# EAGLE design usb-c-adapter-tester (EAGLE 7.2.0)
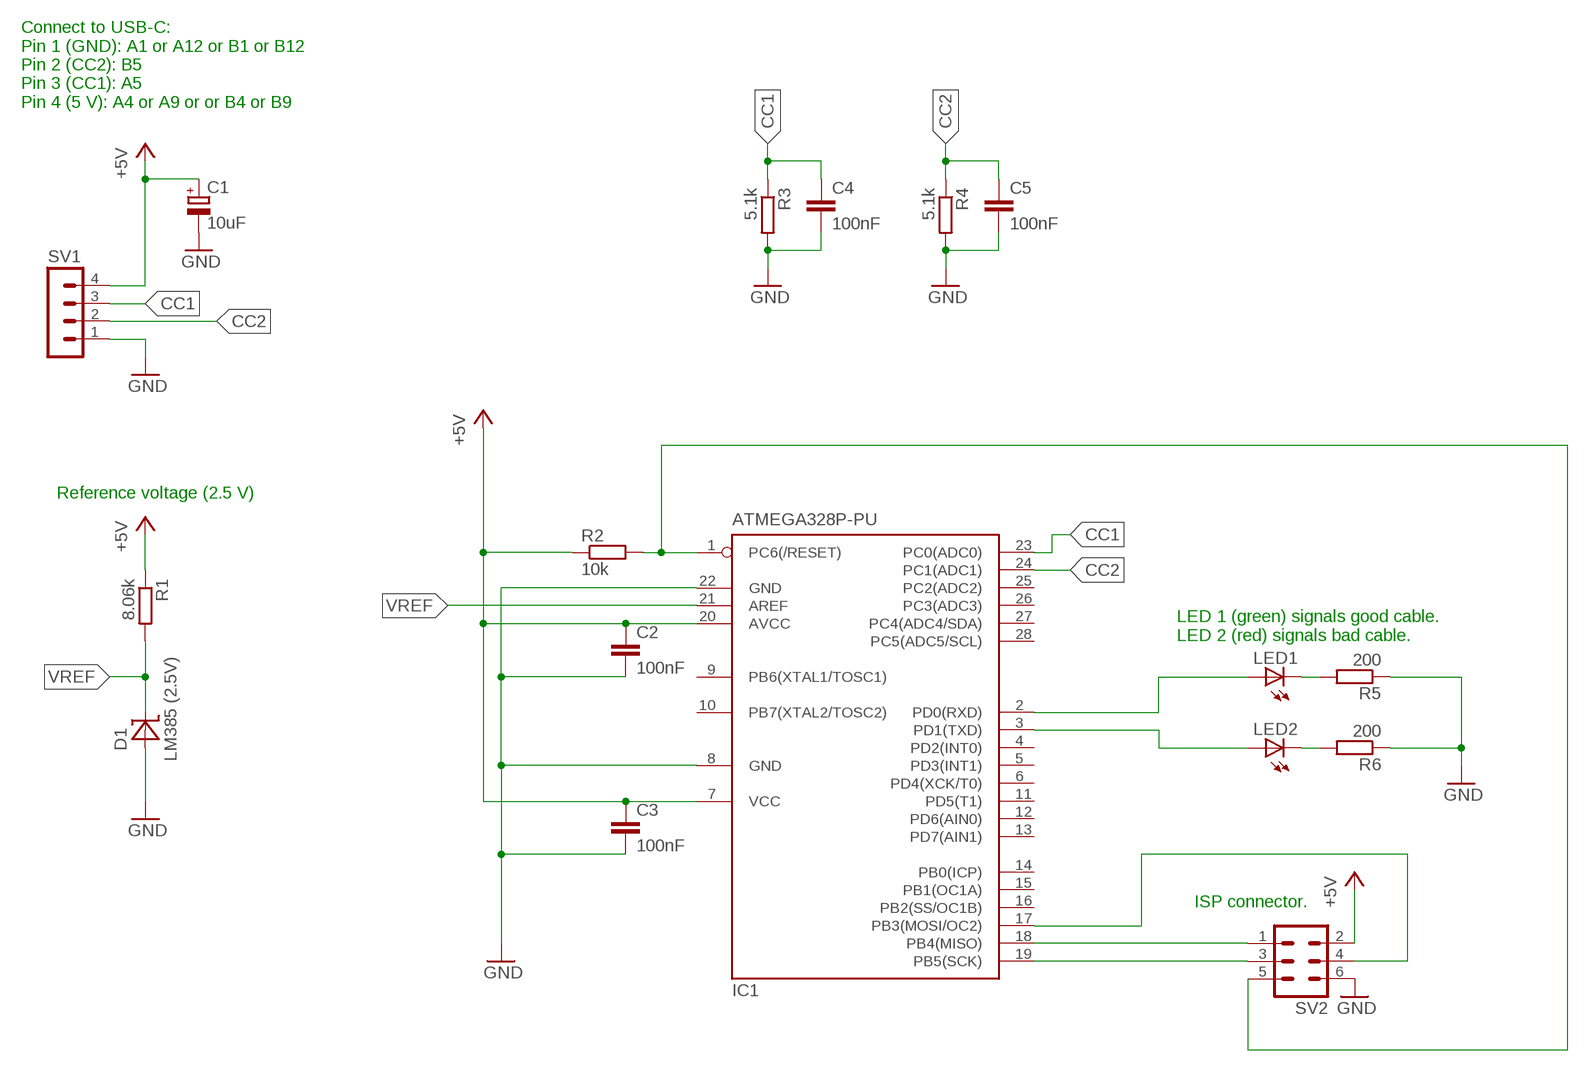
[diagram p0: schematic, sheet 1]

## Parts
C1  10uF  CPOL-EUE2.5-5  [E2,5-5]
C2  100nF  C-EU050-024X044  [C050-024X044]
C3  100nF  C-EU050-024X044  [C050-024X044]
C4  100nF  C-EU050-024X044  [C050-024X044]
C5  100nF  C-EU050-024X044  [C050-024X044]
D1  LM385 (2.5V)  LM385  [TO-92]
IC1  ATMEGA328P-PU  MEGA8-P  [DIL28-3]
LED1  LED5MM  [LED5MM]
LED2  LED5MM  [LED5MM]
R1  8.06k  R-EU_0207/7  [0207/7]
R2  10k  R-EU_0207/7  [0207/7]
R3  5.1k  R-EU_0207/7  [0207/7]
R4  5.1k  R-EU_0207/7  [0207/7]
R5  200  R-EU_0207/7  [0207/7]
R6  200  R-EU_0207/7  [0207/7]
SV1  MA04-1  [MA04-1]
SV2  MA03-2  [MA03-2]

## Nets
CC1: C4.1 IC1.23(PC0(ADC0)) R3.1 SV1.3
CC2: C5.1 IC1.24(PC1(ADC1)) R4.1 SV1.2
GND: C1.- C2.2 C3.2 C4.2 C5.2 D1.+ IC1.8(GND) IC1.22(GND) R3.2 R4.2 R5.1 R6.1 SV1.1 SV2.6
N$2: IC1.1(PC6(/RESET)) R2.2 SV2.5
N$4: LED1.K(C) R5.2
N$6: LED2.K(C) R6.2
N$10: IC1.17(PB3(MOSI/OC2)) SV2.4
N$11: IC1.2(PD0(RXD)) LED1.A
N$12: IC1.18(PB4(MISO)) SV2.1
N$13: IC1.3(PD1(TXD)) LED2.A
N$17: IC1.19(PB5(SCK)) SV2.3
N$18: C1.+ C2.1 C3.1 IC1.7(VCC) IC1.20(AVCC) R1.1 R2.1 SV1.4 SV2.2 ; supply symbol labelled +5V
VREF: D1.- IC1.21(AREF) R1.2
Unconnected: IC1.4(PD2(INT0)) IC1.5(PD3(INT1)) IC1.6(PD4(XCK/T0)) IC1.9(PB6(XTAL1/TOSC1)) IC1.10(PB7(XTAL2/TOSC2)) IC1.11(PD5(T1)) IC1.12(PD6(AIN0)) IC1.13(PD7(AIN1)) IC1.14(PB0(ICP)) IC1.15(PB1(OC1A)) IC1.16(PB2(SS/OC1B)) IC1.25(PC2(ADC2)) IC1.26(PC3(ADC3)) IC1.27(PC4(ADC4/SDA)) IC1.28(PC5(ADC5/SCL))

## Notes on the sheet
- Connect to USB-C:
  Pin 1 (GND): A1 or A12 or B1 or B12
  Pin 2 (CC2): B5
  Pin 3 (CC1): A5
  Pin 4 (5 V): A4 or A9 or or B4 or B9
- Reference voltage (2.5 V)
- LED 1 (green) signals good cable.
  LED 2 (red) signals bad cable.
- ISP connector.

## Library data of the parts
C1 = rcl:CPOL-EU: POLARIZED CAPACITOR, European symbol
C2-C5 = rcl:C-EU: CAPACITOR, European symbol
D1 = lm385:LM385: LM385 LM385 Micropower Voltage Reference
IC1 = atmel:MEGA8-P: MICROCONTROLLER 8 Kbytes FLASH, 1 kbytes SRAM, 512 bytes EEPROM, USART, 4-channel 10 bit ADC, 2-channel 8 bit ADC Pin compatible with Atmega48, ATMega88, ATMega168 Source: avr.lbr; OC_FARNELL: unknown; OC_NEWARK: unknown
LED1 LED2 = led:LED: LED OSRAM: - CHIPLED LG R971, LG N971, LY N971, LG Q971, LY Q971, LO R971, LY R971 LH N974, LH R974 LS Q976, LO Q976, LY Q976 LO Q996 - Hyper CHIPLED LW Q18S LB Q993, LB Q99A, LB R99A - SideLED LS A670, LO A670, LY A670, LG A670, LP A670 LB A673, LV A673, LT A673, LW A673 LH A674 LY A675 LS A676, LA A676, LO A676, LY A676, LW A676 LS A679, LY A679, LG A679 - Hyper Micro SIDELED® LS Y876, LA Y876, LO Y876, LY Y876 LT Y87S - SmartLED LW L88C, LW L88S LB L89C, LB L89S, LG L890 LS L89K, LO L89K, LY L89K LS L896, LA L896, LO L896, LY L896 - TOPLED LS T670, LO T670, LY T670, LG T670, LP T670 LSG T670, LSP T670, LSY T670, LOP T670, LYG T670 LG T671, LOG T671, LSG T671 LB T673, LV T673, LT T673, LW T673 LH T674 LS T676, LA T676, LO T676, LY T676, LB T676, LH T676, LSB T676, LW T676 LB T67C, LV T67C, LT T67C, LS T67K, LO T67K, LY T67K, LW E67C LS E67B, LA E67B, LO E67B, LY E67B, LB E67C, LV E67C, LT E67C LW T67C LS T679, LY T679, LG T679 LS T770, LO T770, LY T770, LG T770, LP T770 LB T773, LV T773, LT T773, LW T773 LH T774 LS E675, LA E675, LY E675, LS T675 LS T776, LA T776, LO T776, LY T776, LB T776 LHGB T686 LT T68C, LB T68C - Hyper Mini TOPLED® LB M676 - Mini TOPLED Santana® LG M470 LS M47K, LO M47K, LY M47K Source: http://www.osram.convergy.de LUXEON: - LUMILED® LXK2-PW12-R00, LXK2-PW12-S00, LXK2-PW14-U00, LXK2-PW14-V00 LXK2-PM12-R00, LXK2-PM12-S00, LXK2-PM14-U00 LXK2-PE12-Q00, LXK2-PE12-R00, LXK2-PE12-S00, LXK2-PE14-T00, LXK2-PE14-U00 LXK2-PB12-K00, LXK2-PB12-L00, LXK2-PB12-M00, LXK2-PB14-N00, LXK2-PB14-P00, LXK2-PB14-Q00 LXK2-PR12-L00, LXK2-PR12-M00, LXK2-PR14-Q00, LXK2-PR14-R00 LXK2-PD12-Q00, LXK2-PD12-R00, LXK2-PD12-S00 LXK2-PH12-R00, LXK2-PH12-S00 LXK2-PL12-P00, LXK2-PL12-Q00, LXK2-PL12-R00 Source: www.luxeon.com KINGBRIGHT: KA-3528ASYC Source: www.kingbright.com
R1-R6 = rcl:R-EU_: RESISTOR, European symbol
SV1 = con-lstb:MA04-1: PIN HEADER; OC_FARNELL: unknown; OC_NEWARK: unknown
SV2 = con-lstb:MA03-2: PIN HEADER; OC_FARNELL: unknown; OC_NEWARK: unknown

## Board
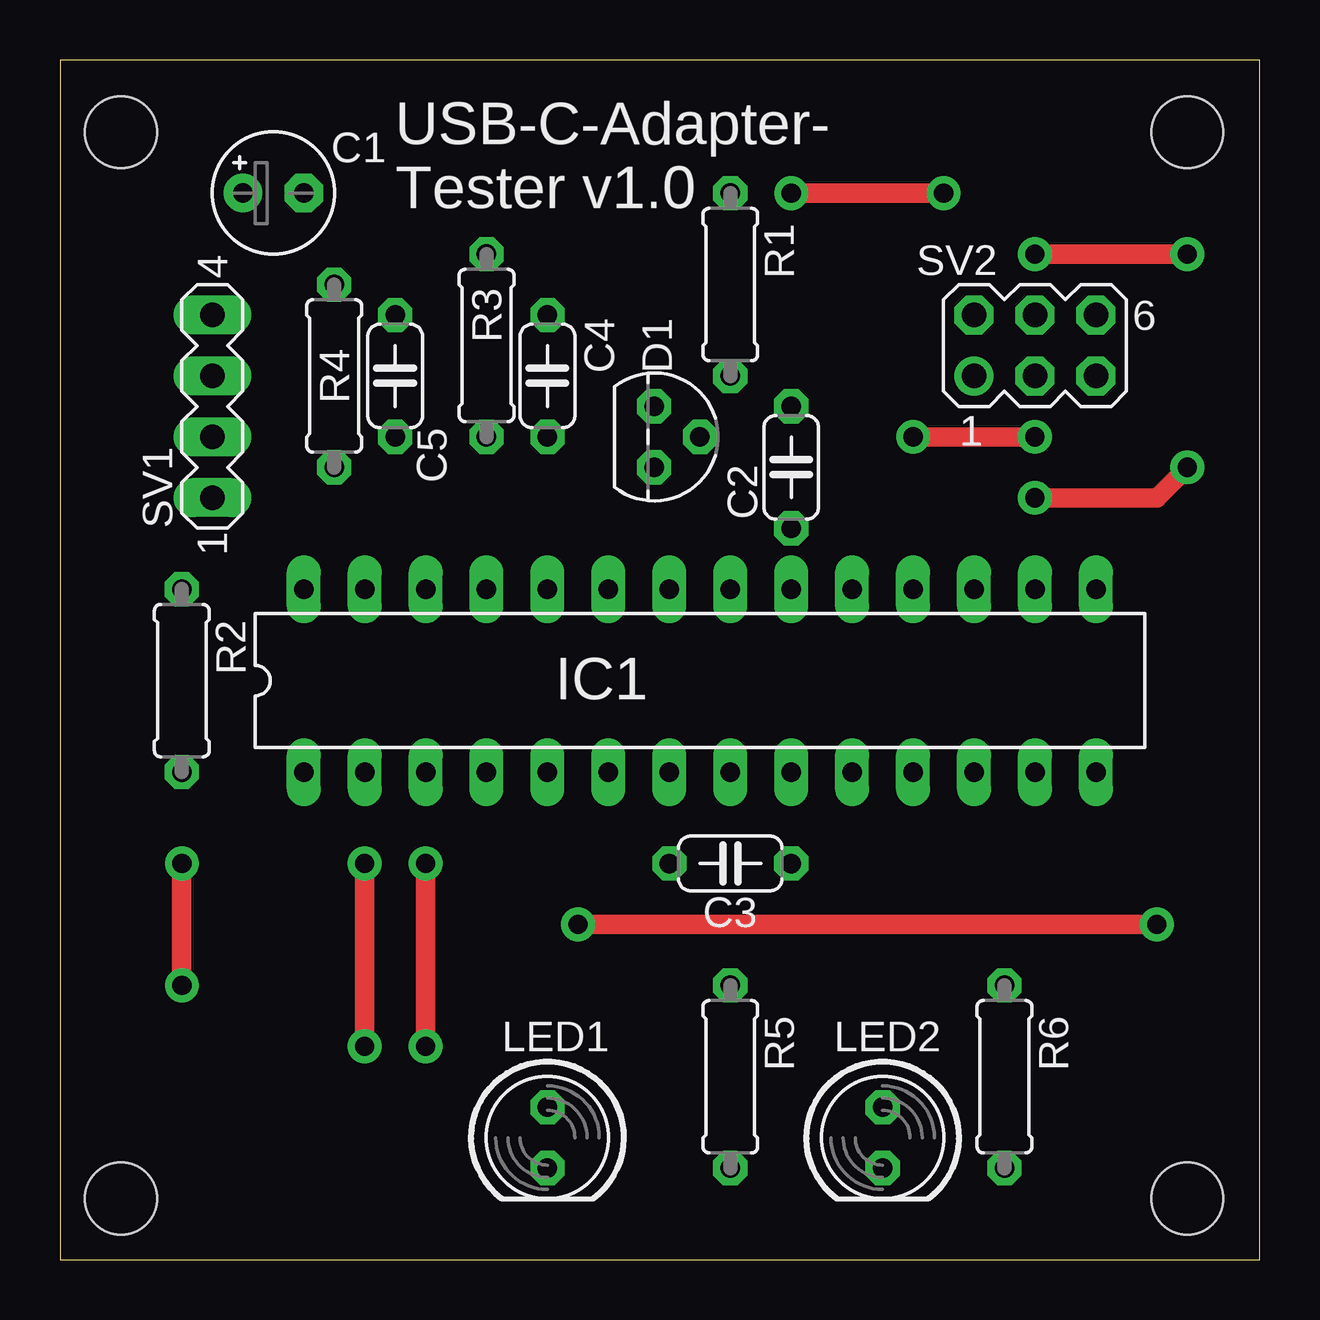
[diagram p1: board, top side]
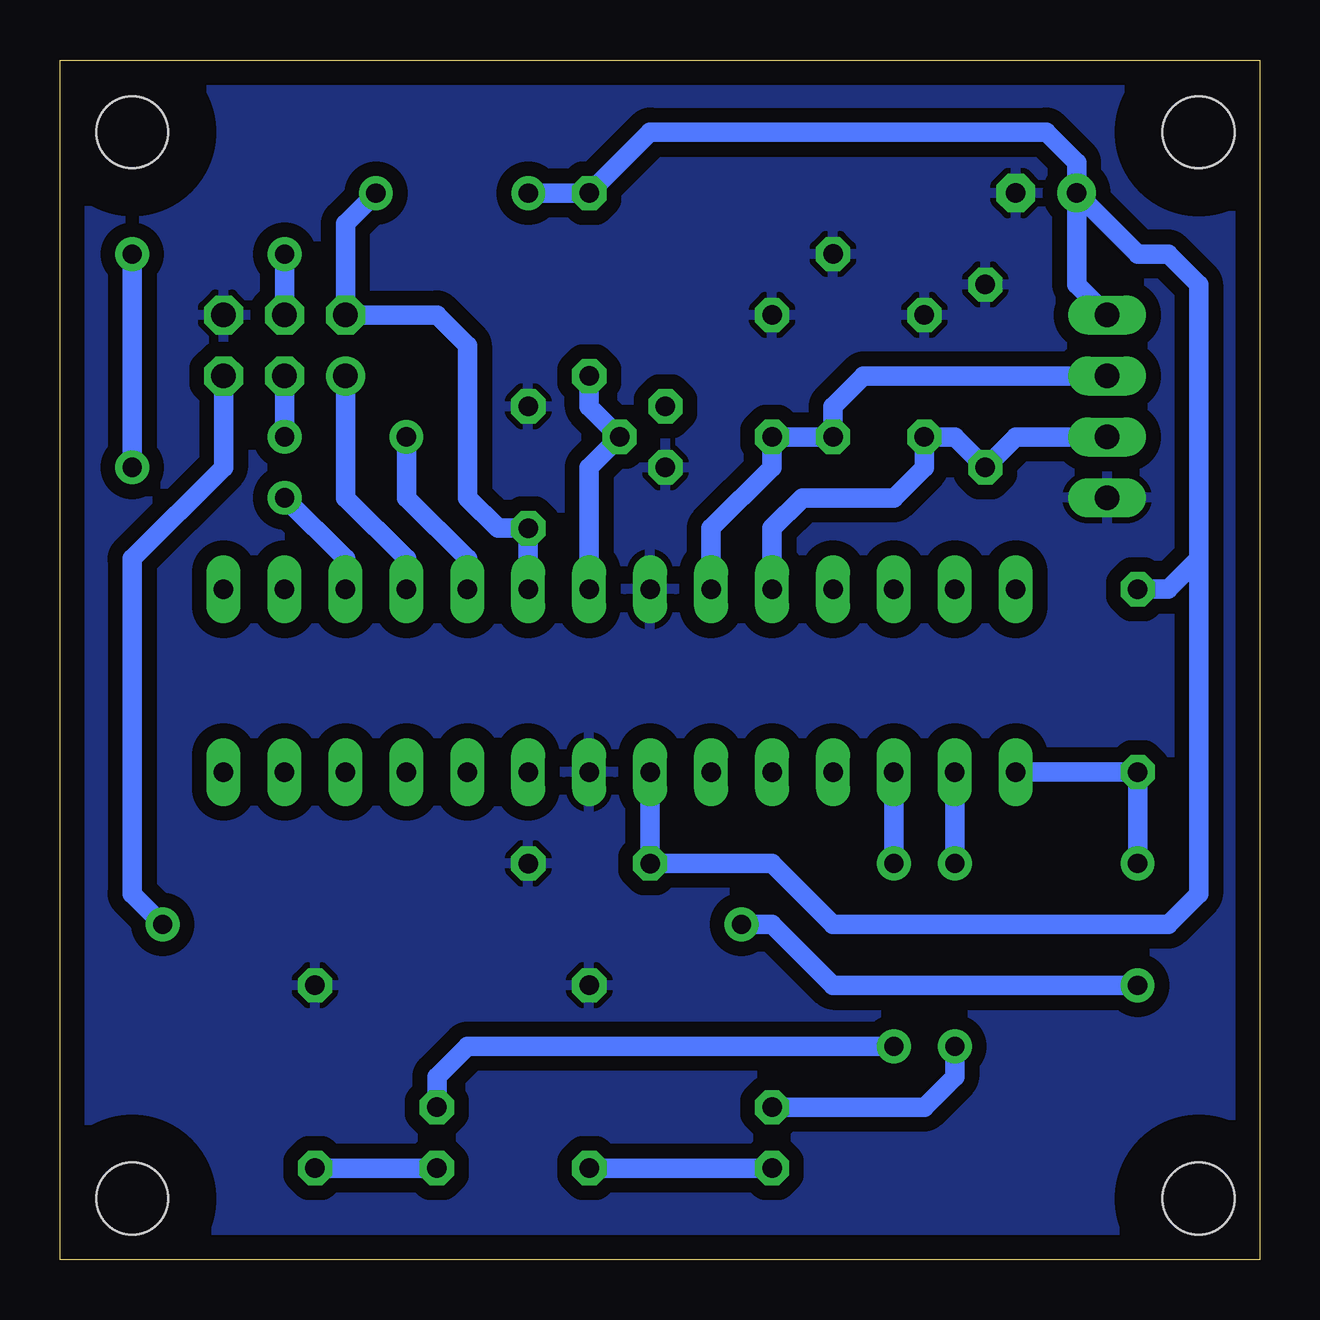
[diagram p2: board, bottom side, seen from below]

Size 50 x 50 mm. Coordinates in mm from the lower left corner, seen from the top.
Outline: 0,0 50,0 50,50 0,50 0,0
Copper layers (1*16): Top 0.035mm / dielectric 1.5mm / Bottom 0.035mm
Design rules "default *": minimum track width 10mil, minimum drill 24mil, track to track 24mil, track to pad 24mil, pad to pad 24mil, via to via 24mil, smd to smd 8mil, copper to edge 40mil, drill to drill 8mil, minimum pad ring 12mil, minimum via ring 12mil, stop-mask expansion 4mil, vias tented up to drill 0mil, thermal gap 10mil
Holes 3 mm at 2.54,46.99 2.54,2.54 46.99,2.54 46.99,46.99
bRestrict: area -1,43.5 to 6,50.5; area 43.5,43.5 to 50.5,50.5; area 43.5,-1 to 50.5,6; area -1,-1 to 6,6

### Footprints (pad centres in the part's own frame; a part is rotated, then mirrored left to right if it is on the bottom)
E2,5-5 = drill 0.813 pad 1.6: + -1.27,0 | drill 0.813 pad 1.6 octagon: - 1.27,0
C050-024X044 = drill 0.813 octagon: 1 -2.54,0; 2 2.54,0
TO-92 = drill 0.813 octagon: + 1.27,0; - 0,1.905; NC -1.27,0
DIL28-3 = drill 0.813 long: 1 -16.51,-3.81; 2 -13.97,-3.81; 3 -11.43,-3.81; 4 -8.89,-3.81; 5 -6.35,-3.81; 6 -3.81,-3.81; 7 -1.27,-3.81; 8 1.27,-3.81; 9 3.81,-3.81; 10 6.35,-3.81; 11 8.89,-3.81; 12 11.43,-3.81; 13 13.97,-3.81; 14 16.51,-3.81; 15 16.51,3.81; 16 13.97,3.81; 17 11.43,3.81; 18 8.89,3.81; 19 6.35,3.81; 20 3.81,3.81; 21 1.27,3.81; 22 -1.27,3.81; 23 -3.81,3.81; 24 -6.35,3.81; 25 -8.89,3.81; 26 -11.43,3.81; 27 -13.97,3.81; 28 -16.51,3.81
LED5MM = drill 0.813 octagon: A -1.27,0; K 1.27,0
0207/7 = drill 0.813 octagon: 1 -3.81,0; 2 3.81,0
MA04-1 = drill 1.016 long: 1 -3.81,0; 2 -1.27,0; 3 1.27,0; 4 3.81,0
MA03-2 = drill 1.016: 1 -2.54,-1.27 | drill 1.016 octagon: 2 -2.54,1.27; 3 0,-1.27; 4 0,1.27; 5 2.54,-1.27; 6 2.54,1.27

### Placement (x,y rotation side)
C1  8.89,44.45 0 top
C2  30.48,33.02 90 top
C3  27.94,16.51 0 top
C4  20.32,36.83 90 top
C5  13.97,36.83 90 top
D1  24.77,34.29 270 top
IC1  26.67,24.13 0 top
LED1  20.32,5.08 270 top
LED2  34.29,5.08 270 top
R1  27.94,40.64 270 top
R2  5.08,24.13 270 top
R3  17.78,38.1 90 top
R4  11.43,36.83 90 top
R5  27.94,7.62 270 top
R6  39.37,7.62 270 top
SV1  6.35,35.56 90 top
SV2  40.64,38.1 0 top

### Tracks (layer width: path | path; a pad name or v marks a point on that pad's centre or on a via)
CC1
  Bottom 0.813: IC1.23 22.86,30.48 20.32,33.02 C4.1 R3.1 17.78,35.56 16.51,36.83 SV1.3
CC2
  Bottom 0.813: SV1.2 10.16,34.29 R4.1 12.7,34.29 C5.1 13.97,33.02 15.24,31.75 19.05,31.75 20.32,30.48 IC1.24
GND
  pour Bottom: -1.27,50.8 101.6,50.8 101.6,-1.27 -1.27,-1.27
N$2  (via drill 0.8)
  Top 0.813: v21.59,13.97 v45.72,13.97 | v5.08,16.51 v5.08,11.43
  Bottom 0.813: IC1.1 R2.2 v5.08,16.51 | v45.72,13.97 46.99,15.24 46.99,29.21 43.18,33.02 SV2.5 | v5.08,11.43 17.78,11.43 20.32,13.97 v21.59,13.97
N$4
  Bottom 0.813: LED1.K R5.2
N$6
  Bottom 0.813: LED2.K R6.2
N$10  (via drill 0.8)
  Top 0.813: v40.64,31.75 45.72,31.75 v46.99,33.02 | v40.64,41.91 v46.99,41.91
  Bottom 0.813: IC1.17 38.1,29.21 v40.64,31.75 | SV2.4 v40.64,41.91 | v46.99,41.91 v46.99,33.02
N$11  (via drill 0.8)
  Top 0.813: v12.7,16.51 v12.7,8.89
  Bottom 0.813: v12.7,8.89 12.7,7.62 13.97,6.35 LED1.A | IC1.2 v12.7,16.51
N$12
  Bottom 0.813: IC1.18 35.56,29.21 38.1,31.75 SV2.1
N$13  (via drill 0.8)
  Top 0.813: v15.24,16.51 v15.24,8.89
  Bottom 0.813: v15.24,8.89 33.02,8.89 34.29,7.62 LED2.A | IC1.3 v15.24,16.51
N$17  (via drill 0.8)
  Top 0.813: v35.56,34.29 v40.64,34.29
  Bottom 0.813: IC1.19 33.02,29.21 35.56,31.75 v35.56,34.29 | v40.64,34.29 SV2.3
N$18  (via drill 0.8)
  Top 0.813: v30.48,44.45 v36.83,44.45
  Bottom 0.813: v36.83,44.45 38.1,43.18 SV2.2 34.29,39.37 33.02,38.1 33.02,31.75 31.75,30.48 C2.1 IC1.20 | 2.54,29.21 2.54,40.64 3.81,41.91 5.08,41.91 C1.+ | 2.54,29.21 3.81,27.94 R2.1 | 2.54,29.21 2.54,15.24 3.81,13.97 17.78,13.97 20.32,16.51 C3.1 IC1.7 | v30.48,44.45 R1.1 25.4,46.99 8.89,46.99 7.62,45.72 C1.+ | SV1.4 7.62,40.64 C1.+
VREF
  Bottom 0.813: IC1.21 27.94,33.02 D1.- 27.94,35.56 R1.2

### Text on the board
tNames: USB-C-Adapter- / Tester v1.0